# EAGLE design MiniWhip (EAGLE 8.6.0)
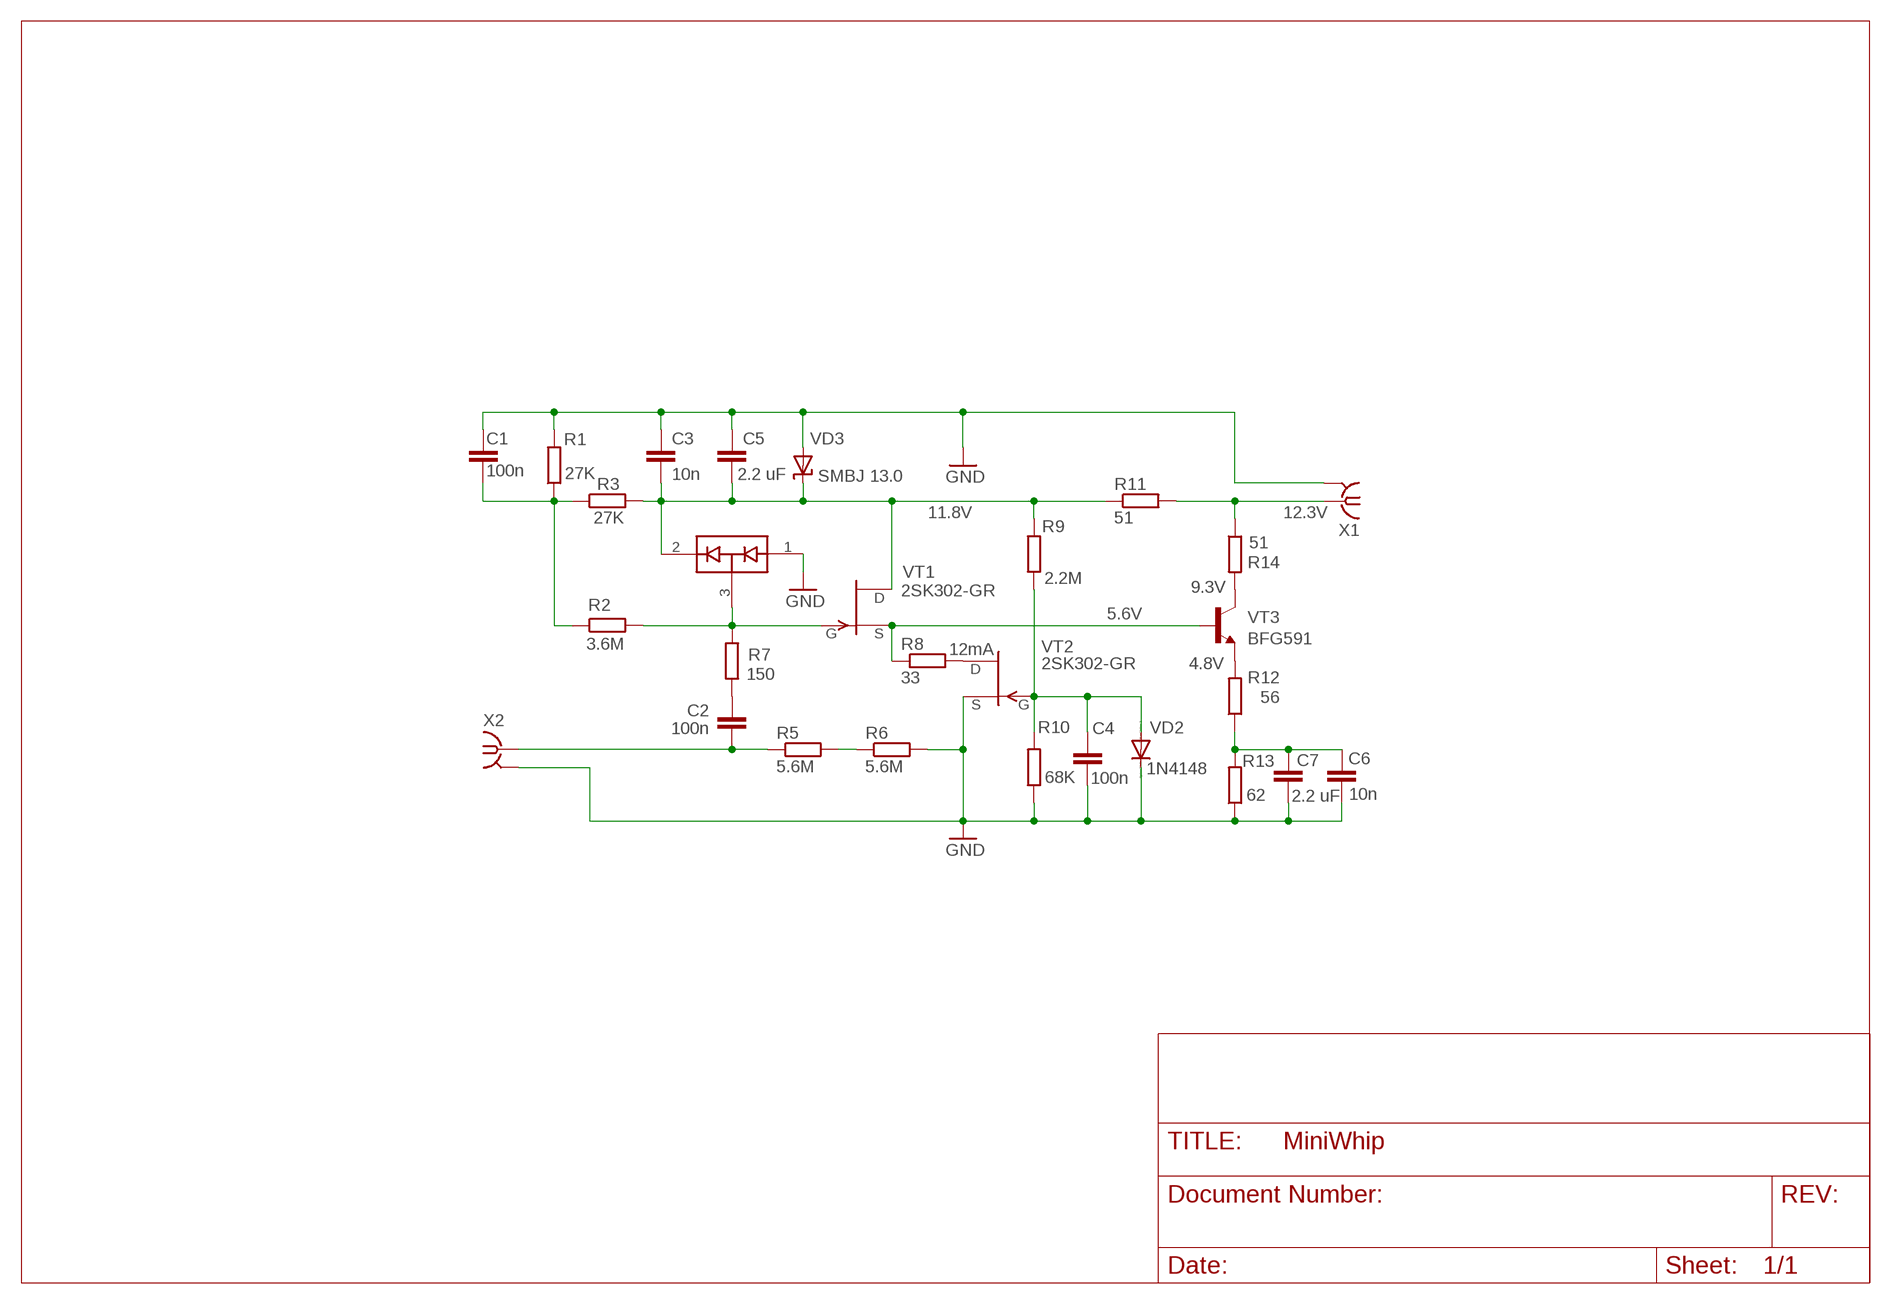
[diagram p0: schematic, sheet 1]

## Parts
C1  100n  C-EUC0603  [C0603]
C2  100n  C-EUC0603  [C0603]
C3  10n  C-EUC0603  [C0603]
C4  100n  C-EUC0603  [C0603]
C5  2.2 uF  C-EUC0603  [C0603]
C6  10n  C-EUC0603  [C0603]
C7  2.2 uF  C-EUC0603  [C0603]
R1  27K  R-EU_R0603  [R0603]
R2  3.6M  R-EU_R0805  [R0805]
R3  27K  R-EU_R0603  [R0603]
R5  5.6M  R-EU_R0805  [R0805]
R6  5.6M  R-EU_R0805  [R0805]
R7  150  R-EU_R0805  [R0805]
R8  33  R-EU_R0805  [R0805]
R9  2.2M  R-EU_R0603  [R0603]
R10  68K  R-EU_R0603  [R0603]
R11  51  R-EU_R0603  [R0603]
R12  56  R-EU_R0603  [R0603]
R13  62  R-EU_R0603  [R0603]
R14  51  R-EU_R0603  [R0603]
VD1  BAV99  [SOT23]
VD2  1N4148  DIODE-SOD80C  [SOD80C]
VD3  SMBJ 13.0  SUPPRESSOR-SMBJ  [SMBJ]
VT1  2SK302SOT23  [SOT23]
VT2  2SK302SOT23  [SOT23]
VT3  BFG591  [SOT223]
X1  SMA-142-0701-801/806  [J502-ND-142-0701-801/806]
X2  SMA-142-0701-801/806  [J502-ND-142-0701-801/806]

## Nets
+12V: C3.2 C5.2 R3.2 R9.2 R11.1 VD1.2(C2) VD3.C VT1.1(D)
GND: C1.1 C3.1 C4.2 C5.1 C6.2 C7.2 R1.2 R6.2 R10.1 R13.1 VD1.1(A1) VD2.C VD3.A VT2.3(S) X1.G@1 X1.G@2 X1.G@3 X1.G@4 X2.G@1 X2.G@2 X2.G@3 X2.G@4
IN: C2.2 R5.1 X2.1
N$1: C1.2 R1.1 R2.1 R3.1
N$4: R14.2 VT3.4(C)
N$5: R2.2 R7.1 VD1.3(COM) VT1.2(G)
N$6: C6.1 C7.1 R12.1 R13.2
N$7: R12.2 VT3.1(E) VT3.3(E)
N$9: R8.2 VT2.1(D)
N$10: C4.1 R9.1 R10.2 VD2.A VT2.2(G)
N$11: C2.1 R7.2
N$12: R5.2 R6.1
OUT: R11.2 R14.1 X1.1
PREAMP: R8.1 VT1.3(S) VT3.2(B)

## Notes on the sheet
- 11.8V | 12.3V
- 2SK302-GR | 9.3V
- 5.6V
- 12mA
- 2SK302-GR | 4.8V

## Library data of the parts
C1-C7 = resistor:C-EU: CAPACITOR, European symbol
R1-R3 R5-R14 = resistor:R-EU_: RESISTOR, European symbol
VD1 = SparkFun-DiscreteSemi:BAV99: Two small signal silicon diodes connected anode to cathode. Connections to all three nodes available. DIO-10647; PROD_ID: DIO-10647
VD2 = diode:DIODE-: DIODE
VD3 = diode:SUPPRESSOR-: Suppressor diode
VT1 VT2 = transistor-fet-my:2SK302: Silicon N-Channel MOS FET Source: HITACHI .. 2SK439.pdf
VT3 = transistor-npn-my:BFG591: NPN Transistor
X1 X2 = con-coax:SMA-: SMA 50 Ohm End Launch Jack Receptacle - Round Contact Johnson Components Source: www.johnsoncomponents.com .. J502-ND.pdf; MF: JOHNSON COMPONENTS; MPN: 142-0701-801; OC_FARNELL: 1608592; OC_NEWARK: 90F2624

## Net classes
0 default: clearance 0.205 mm

## Board
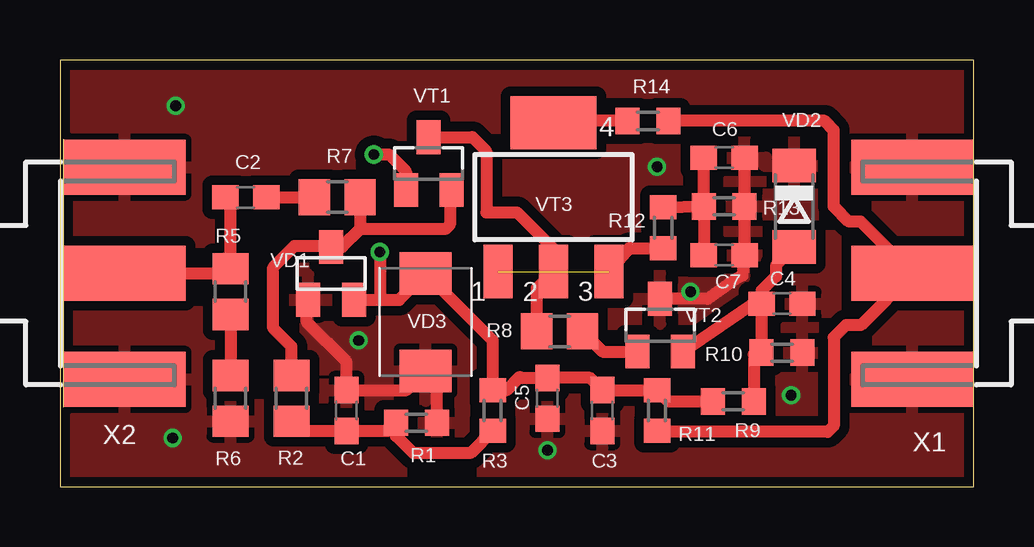
[diagram p1: board, top side]
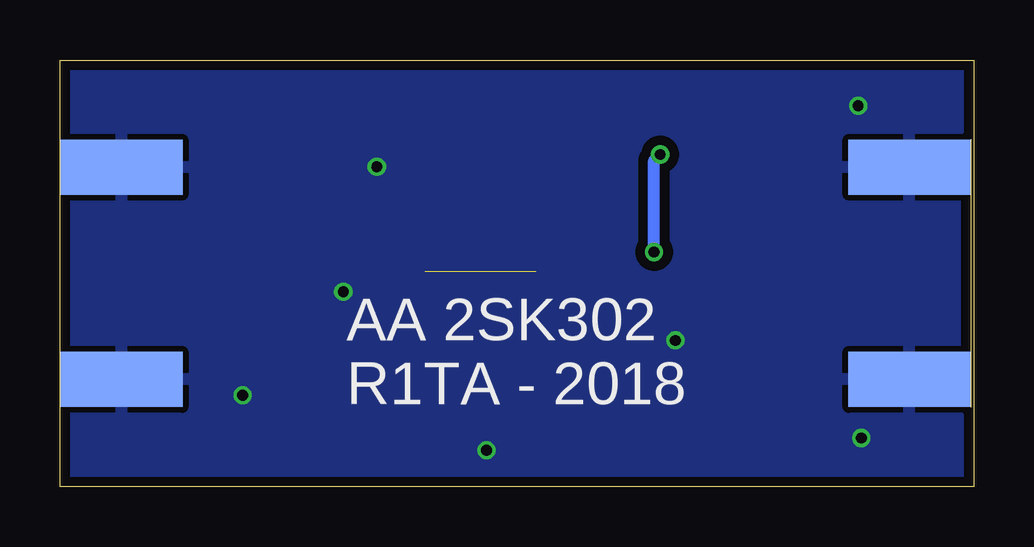
[diagram p2: board, bottom side, seen from below]

Size 38.1 x 17.78 mm. Coordinates in mm from the lower left corner, seen from the top.
Outline: 0,0 38.1,0 38.1,17.78 0,17.78 0,0
Copper layers (1*16): Top 0.035mm / dielectric 1.5mm / Bottom 0.035mm
Design rules "SeeedStudio_2layer_DRU_no_angle_20140221": minimum track width 6mil, minimum drill 12mil, track to track 6mil, track to pad 6mil, pad to pad 6mil, via to via 6mil, smd to smd 0mil, copper to edge 10mil, drill to drill 10mil, minimum pad ring 10mil, minimum via ring 6mil, stop-mask expansion 2mil, vias tented up to drill 100mil, thermal gap 10mil

### Footprints (pad centres in the part's own frame; a part is rotated, then mirrored left to right if it is on the bottom)
C0603 = smd 1.1 x 1: 1 -0.85,0; 2 0.85,0
R0603 = smd 1 x 1.1: 1 -0.85,0; 2 0.85,0
R0805 = smd 1.3 x 1.5: 1 -0.95,0; 2 0.95,0
SOT23 = smd 1 x 1.4: 1 -0.95,-1.1; 2 0.95,-1.1; 3 0,1.1
SOD80C = smd 1.4 x 1.8: A 1.7,0; C -1.7,0
SMBJ = smd 1.78 x 2.16: A 2.04,0; C -2.03,0
SOT223 = smd 1.219 x 2.235: 1 -2.311,-3.099; 2 0,-3.099; 3 2.311,-3.099 | smd 3.6 x 2.2: 4 0,3.099
J502-ND-142-0701-801/806 = smd 5.08 x 2.286: 1 2.565,0; G@1 2.565,4.42; G@2 2.565,-4.42 | smd 5.08 x 2.286 bottom: G@3 2.565,4.42; G@4 2.565,-4.42

### Placement (x,y rotation side)
C1  11.94,3.17 270 top
C2  7.75,12.06 180 top
C3  22.61,3.17 90 top
C4  30.1,7.62 0 top
C5  20.32,3.68 90 top
C6  27.69,13.72 0 top
C7  27.69,9.65 0 top
R1  14.86,2.67 0 top
R2  9.65,3.68 90 top
R3  18.03,3.17 90 top
R5  7.11,8.13 270 top
R6  7.11,3.68 270 top
R7  11.56,12.06 180 top
R8  20.83,6.48 0 top
R9  28.07,3.56 180 top
R10  30.1,5.59 180 top
R11  24.89,3.17 270 top
R12  25.15,10.79 270 top
R13  27.69,11.68 180 top
R14  24.51,15.24 180 top
VD1  11.3,8.89 0 top
VD2  30.61,11.68 270 top
VD3  15.24,6.86 270 top
VT1  15.37,13.46 0 top
VT2  25.02,6.73 0 top
VT3  20.57,12.06 0 top
X1  38.1,8.89 180 top
X2  0.13,8.89 0 top

### Tracks (layer width: path | path; a pad name or v marks a point on that pad's centre or on a via)
+12V  (via drill 0.45)
  Top 0.508: VD1.2 13.34,7.79 | 13.34,7.79 14.14,7.79 VD3.C 18.03,6.09 R3.2 18.63,4.03 19.18,4.57 19.22,4.53 C5.2 22.1,4.53 C3.2 R11.1 25.36,3.56 R9.2 | v13.08,13.84 13.72,13.84 14.42,13.14 VT1.1 | v13.34,9.78 13.34,7.79
  Bottom 0.508: v13.34,9.78 13.34,13.59 v13.08,13.84
GND  (via drill 0.45)
  Top 0.508: R1.2 15.71,4.35 VD3.A 14.45,4.03 C1.1 11.94,5.21 10.29,6.86 10.29,7.72 VD1.1 | C6.2 R13.1 C7.2 28.45,8.8 27.94,8.51 27.01,7.83 VT2.3
  other vias: 4.7,2.03 12.45,6.1 20.32,1.52 26.29,8.13 30.48,3.81 24.89,13.34 4.83,15.88
  pour Top (isolate 0.406): 0,0 0,17.78 38.1,17.78 38.1,0
  pour Bottom (isolate 0.406): 0,0 0,17.78 38.1,17.78 38.1,0
IN
  Top 0.508: 6.92,9.53 R5.1 7.11,9.53 | 7.11,9.53 7.11,11.85 C2.2 | X2.1 6.48,8.89 7.11,9.53
N$1
  Top 0.508: R2.1 10.06,2.33 C1.2 13.67,2.33 R1.1 14.01,2.12 14.73,1.4 17.11,1.4 R3.1
N$4
  Top 0.508: 20.78,15.37 VT3.4 20.65,15.24 R14.2
N$5
  Top 0.508: R7.1 12.51,10.73 | 12.51,10.73 11.77,9.99 VD1.3 11.26,10.03 9.78,10.03 8.89,9.14 8.89,6.6 9.65,5.84 R2.2 | VT1.2 16.26,12.3 16.26,10.92 16.06,10.73 12.51,10.73
N$6
  Top 0.508: R12.1 25.1,11.64 R13.2 | R13.2 C6.1 | R13.2 C7.1
N$7  (1 unrouted)
  Top 0.508: 22.98,9.06 VT3.3 23.74,9.95 R12.2
N$9
  Top 0.508: R8.2 22.62,5.63 VT2.1
N$10
  Top 0.508: VT2.2 29.21,7.83 C4.1 | VD2.A 29.84,9.22 29.84,8.76 29.25,8.17 C4.1 | C4.1 R10.2 28.92,5.51 R9.1
N$11
  Top 0.508: C2.1 R7.2
N$12
  Top 0.508: R5.2 R6.1
OUT
  Top 0.508: X1.1 34.16,8.51 34.1,8.57 | X1.1 33.38,11.05 32.89,11.05 32.26,11.68 32.26,14.86 31.88,15.24 R14.1 | X1.1 33.38,6.73 32.77,6.73 32.26,6.22 32.26,2.54 32,2.29 24.93,2.29 R11.2
PREAMP
  Top 0.508: R8.1 19.88,8.27 VT3.2 20.57,9.91 19.05,11.43 17.78,11.43 17.78,13.97 17.19,14.56 VT1.3

### Text on the board
bNames: AA 2SK302 / R1TA - 2018